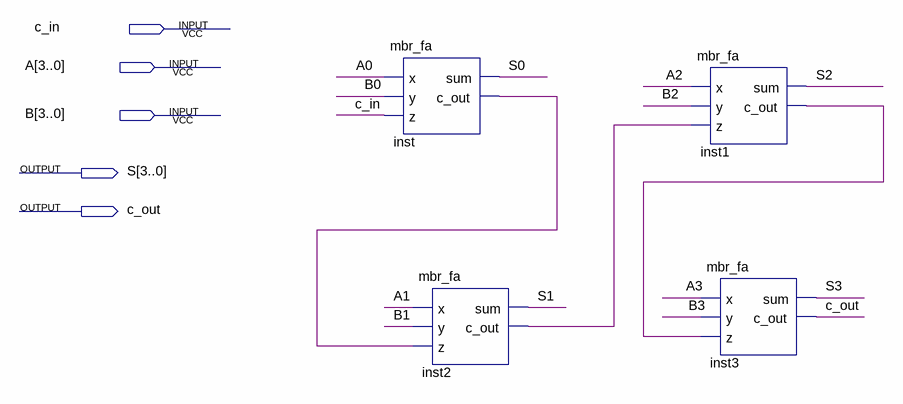
[diagram p0: schematic sheet]
// Quartus schematic mbr_somador_4b.bdf as structural Verilog: 4 symbols, 5 pins
module mbr_somador_4b (
  input  c_in,
  input  [3:0] A,
  input  [3:0] B,
  output [3:0] S,
  output c_out
);

  wire inst1_c_out, inst2_c_out, inst_c_out;

  mbr_fa inst (.x(A[0]), .y(B[0]), .z(c_in), .sum(S[0]), .c_out(inst_c_out));
  mbr_fa inst2 (.x(A[1]), .y(B[1]), .z(inst_c_out), .sum(S[1]), .c_out(inst2_c_out));
  mbr_fa inst1 (.x(A[2]), .y(B[2]), .z(inst2_c_out), .sum(S[2]), .c_out(inst1_c_out));
  mbr_fa inst3 (.x(A[3]), .y(B[3]), .z(inst1_c_out), .sum(S[3]), .c_out(c_out));
endmodule
